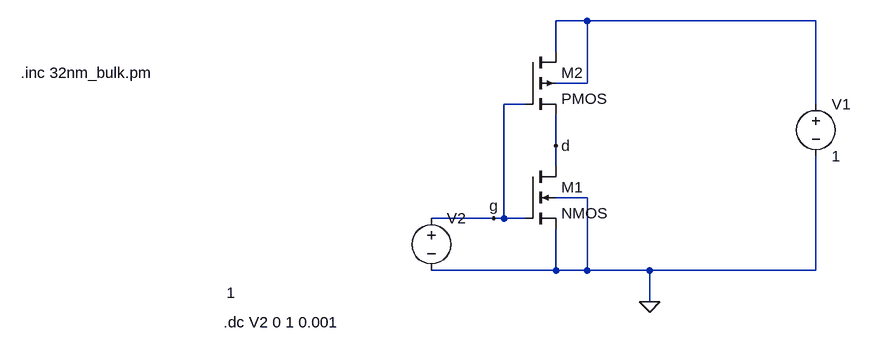
[diagram p0: schematic invertor.asc]
invertor.asc, the LTspice schematic file:
Version 4
SHEET 1 1184 680
WIRE 240 -80 192 -80
WIRE 592 -80 240 -80
WIRE 192 -32 192 -80
WIRE 240 16 240 -80
WIRE 240 16 192 16
WIRE 144 48 112 48
WIRE 592 48 592 -80
WIRE 192 112 192 64
WIRE 192 144 192 112
WIRE 240 192 192 192
WIRE 96 224 0 224
WIRE 112 224 112 48
WIRE 112 224 96 224
WIRE 144 224 112 224
WIRE 192 304 192 240
WIRE 192 304 0 304
WIRE 240 304 240 192
WIRE 240 304 192 304
WIRE 336 304 240 304
WIRE 592 304 592 128
WIRE 592 304 336 304
WIRE 336 352 336 304
FLAG 336 352 0
FLAG 192 112 d
FLAG 96 224 g
SYMBOL voltage 592 32 R0
WINDOW 123 0 0 Left 0
WINDOW 39 0 0 Left 0
SYMATTR InstName V1
SYMATTR Value 1
SYMBOL voltage 0 208 R0
WINDOW 123 0 0 Left 0
WINDOW 39 0 0 Left 0
WINDOW 3 -315 130 Left 2
SYMATTR Value 1
SYMATTR InstName V2
SYMBOL pmos4 144 -32 R0
SYMATTR InstName M2
SYMATTR Value2 l=32e-9 w=640e-9 ad=51200e-18 as=51200e-18 pd=960e-9 ps=960e-9
SYMBOL nmos4 144 144 R0
SYMATTR InstName M1
SYMATTR Value2 l=32e-9 w=320e-9 ad=51200e-18 as=51200e-18 pd=960e-9 ps=960e-9
TEXT -320 384 Left 2 !.dc V2 0 1 0.001
TEXT -632 0 Left 2 !.inc 32nm_bulk.pm

The netlist it stands for:
* invertor.asc
V1 N001 0 1
V2 g 0 1
M2 N001 g d N001 PMOS l=32e-9 w=640e-9 ad=51200e-18 as=51200e-18 pd=960e-9 ps=960e-9
M1 d g 0 0 NMOS l=32e-9 w=320e-9 ad=51200e-18 as=51200e-18 pd=960e-9 ps=960e-9
.model NMOS NMOS
.model PMOS PMOS
.lib standard.mos
.dc V2 0 1 0.001
.inc 32nm_bulk.pm
.backanno
.end

* Results of the author's LTspice run, read from the files saved beside the schematic
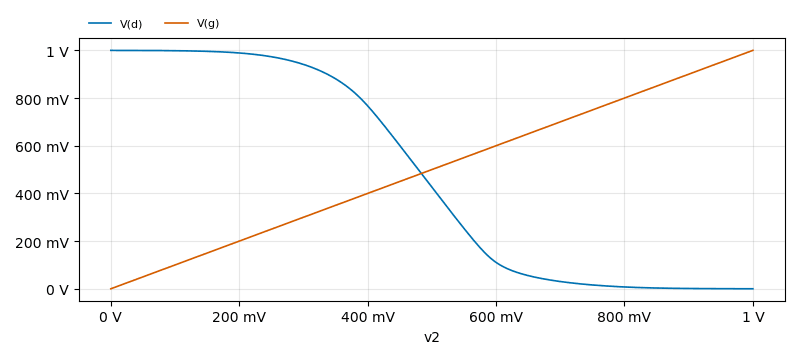
[diagram p1: DC transfer characteristic of invertor.asc, plotted from the saved traces]
* DC transfer characteristic, 1 run:
*   V(d): 999.9 mV at v2=0 V, 152.8 µV at v2=1 V, min 152.8 µV, max 999.9 mV
*   V(g): 0 V at v2=0 V, 1 V at v2=1 V, min 0 V, max 1 V